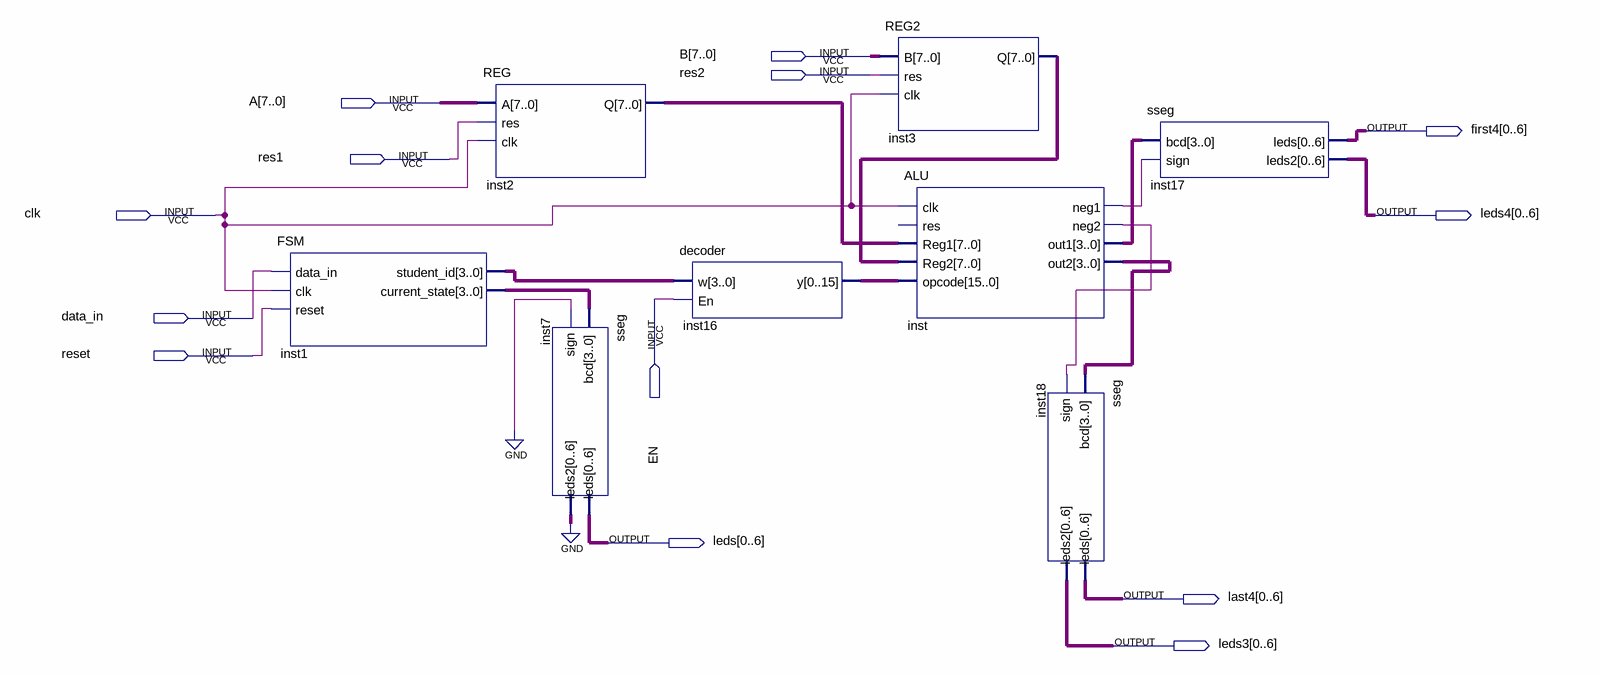
[diagram p0: schematic sheet]
// Quartus schematic CPU.bdf as structural Verilog: 8 symbols, 13 pins
module CPU (
  input  [7:0] B,
  input  res2,
  input  [7:0] A,
  input  res1,
  input  clk,
  input  EN,
  input  data_in,
  input  reset,
  output [0:6] first4,
  output [0:6] leds4,
  output [0:6] leds,
  output [0:6] last4,
  output [0:6] leds3
);

  wire inst_neg1, inst_neg2;
  wire [3:0] inst1_current_state, inst1_student_id, inst_out1, inst_out2;
  wire [6:0] inst7_leds2;
  wire [7:0] inst2_q, inst3_q;
  wire [15:0] inst16_y;

  FSM inst1 (
    .data_in(data_in), .clk(clk), .reset(reset), .student_id(inst1_student_id),
    .current_state(inst1_current_state));
  REG inst2 (.A(A), .res(res1), .clk(clk), .Q(inst2_q));
  sseg inst7 (.bcd(inst1_current_state), .sign(1'b0), .leds(leds), .leds2(inst7_leds2));
  decoder inst16 (.w(inst1_student_id), .En(EN), .y(inst16_y));
  REG2 inst3 (.B(B), .res(res2), .clk(clk), .Q(inst3_q));
  ALU inst (
    .clk(clk), .Reg1(inst2_q), .Reg2(inst3_q), .opcode(inst16_y), .neg1(inst_neg1), .neg2(inst_neg2),
    .out1(inst_out1), .out2(inst_out2));  // open: res
  sseg inst18 (.bcd(inst_out2), .sign(inst_neg2), .leds(last4), .leds2(leds3));
  sseg inst17 (.bcd(inst_out1), .sign(inst_neg1), .leds(first4), .leds2(leds4));
  // also tied to GND on the sheet: {inst7_leds2[0], inst7_leds2[1], inst7_leds2[2], inst7_leds2[3], inst7_leds2[4], inst7_leds2[5], inst7_leds2[6]}
endmodule
